# Altium schematic sheet Motor_driver.SchDoc
size A4; SheetNumber: 3; SheetTotal: 4
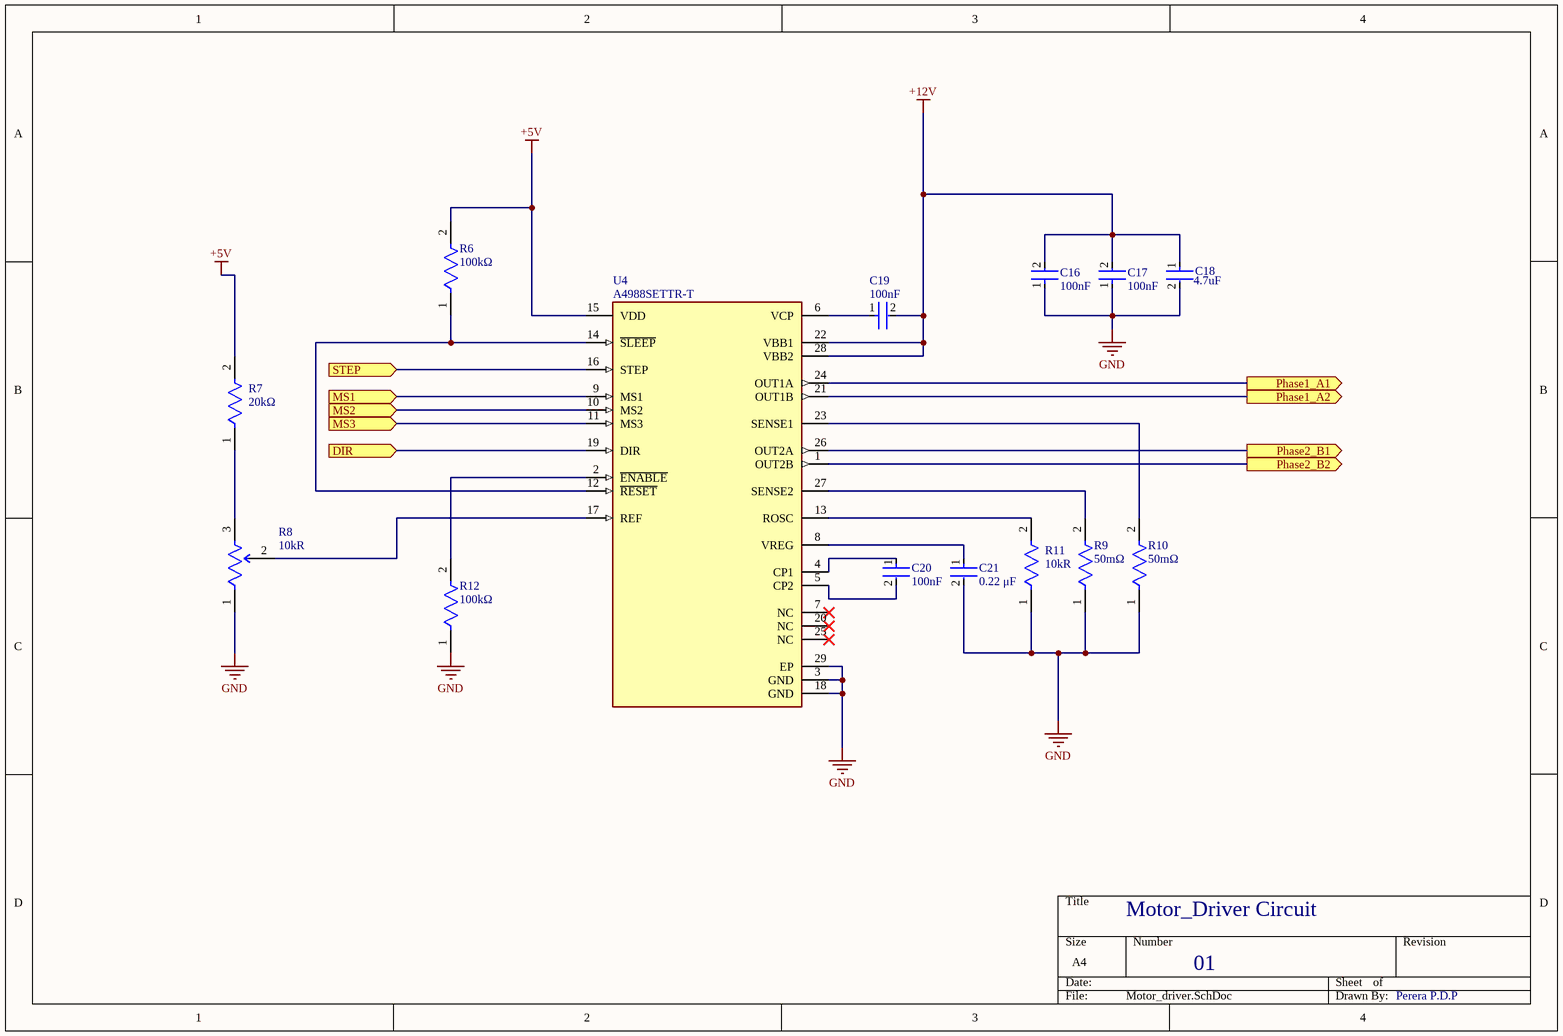
[diagram p0: Motor_driver.SchDoc]

## Parts
C16  Capacitance: 100nF  [FP-0805-L_2_01_0_2-W_1_25-IPC_C]  (hidden comment: 08055C104KAT2A)
C17  Capacitance: 100nF  [FP-0805-L_2_01_0_2-W_1_25-IPC_C]  (hidden comment: 08055C104KAT2A)
C18  Capacitance: 4.7uF  [FP-0805-L_2_01_0_2-W_1_25-MFG]  (hidden comment: 0805YC475KAT2A)
C19  Capacitance: 100nF  [FP-0805-L_2_01_0_2-W_1_25-IPC_C]  (hidden comment: 08055C104KAT2A)
C20  Capacitance: 100nF  [FP-0805-L_2_01_0_2-W_1_25-IPC_C]  (hidden comment: 08055C104KAT2A)
C21  value 0.22 μF  [FP-C0805C-DN-MFG]  (hidden comment: C0805C224K5RACTU)
R6  Resistance: 100kΩ  [FP-RC0805-0_6-IPC_C]  (hidden comment: RC0805FR-07100KL)
R7  Resistance: 20kΩ  [FP-ERA6A-MFG]  (hidden comment: ERA6AEB203V)
R8  Resistance: 10kR  [FP-3361P-MFG]  (hidden comment: 3361P-1-103GLF)
R9  Resistance: 50mΩ  [FP-WSL2512-MFG]  (hidden comment: WSL2512R0500FEA)
R10  Resistance: 50mΩ  [FP-WSL2512-MFG]  (hidden comment: WSL2512R0500FEA)
R11  Resistance: 10kR  [FP-CRCW0805-e3-IPC_A]  (hidden comment: CRCW080510K0FKEA)
R12  Resistance: 100kΩ  [FP-RC0805-0_6-IPC_C]  (hidden comment: RC0805FR-07100KL)
U4  A4988SETTR-T  [FP-ET-28-MFG]

## Ports
DIR (in, see TOP[3B], MCU[3B]), MS1 (in, see TOP[3B], MCU[3B]), MS2 (in, see TOP[3B], MCU[3B]), MS3 (in, see TOP[3B], MCU[3B]), Phase1_A1 (out, see TOP[3B]), Phase1_A2 (out, see TOP[3B]), Phase2_B1 (out, see TOP[3B]), Phase2_B2 (out, see TOP[3B]), STEP (in, see TOP[3B], MCU[3B])

## Nets
+5V: R6.2 R7.2 U4.15(VDD)
+12V: C16.2 C17.2 C18.1 C19.2 U4.22(VBB1) U4.28(VBB2)
GND: C16.1 C17.1 C18.2 C21.2 R8.1(CCW) R9.1 R10.1 R11.1 R12.1 U4.3(GND) U4.18(GND) U4.29(EP)
DIR: U4.19(DIR) ; port DIR
MS1: U4.9(MS1) ; port MS1
MS2: U4.10(MS2) ; port MS2
MS3: U4.11(MS3) ; port MS3
Phase1_A1: U4.24(OUT1A) ; port Phase1_A1
Phase1_A2: U4.21(OUT1B) ; port Phase1_A2
Phase2_B1: U4.26(OUT2A) ; port Phase2_B1
Phase2_B2: U4.1(OUT2B) ; port Phase2_B2
STEP: U4.16(STEP) ; port STEP
NetC19_1: C19.1 U4.6(VCP)
NetC20_1: C20.1 U4.4(CP1)
NetC20_2: C20.2 U4.5(CP2)
NetC21_1: C21.1 U4.8(VREG)
NetR6_1: R6.1 U4.12(~{RESET}) U4.14(~{SLEEP})
NetR7_1: R7.1 R8.3(CW)
NetR8_2: R8.2(WIPER) U4.17(REF)
NetR9_2: R9.2 U4.27(SENSE2)
NetR10_2: R10.2 U4.23(SENSE1)
NetR11_2: R11.2 U4.13(ROSC)
NetR12_2: R12.2 U4.2(~{ENABLE})

Not connected (* = marked no-connect by the designer): U4 7(NC)* 20(NC)* 25(NC)*

## Notes on the sheet
- Motor_Driver Circuit
- 01
- Perera P.D.P

## Library data of the parts
C16 C17 C19 C20 = CMP-2000-05016-2: General Purpose Ceramic Capacitor, 0805, 100nF, 10%, X7R, 0.15, 50V; Dissipation Factor: 2.5%; Insulation Resistance: 100GR; Voltage Rating (DC): 50V; Package Quantity: 4000; Tolerance: 10%; Voltage Rating: 50V; Dielectric: X7R; Case/Package: 0805; Lead Free: Lead Free; Dielectric Material: Ceramic; Thickness: 0.037inch; Weight: 0.001411oz; Max Operating Temperature: 125°C; REACH SVHC: No SVHC; Mount: Surface Mount; RoHS Compliant: Yes; Depth: 1.25mm; Height: 0.5mm; Case Code (Metric): 2012; Length: 2mm; Termination: Standard; Case Code (Imperial): 0805; Number of Pins: 2; Voltage: 50V; Radiation Hardening: No; Min Operating Temperature: -55°C; Width: 1.2mm; Series: MLCC X7R; Packaging: Cut Tape
C18 = CMP-2007-04518-2: General Purpose Ceramic Capacitor, 0805, 4.7uF, 10%, X7R, 15%, 16V; Dissipation Factor: 3.5%; Voltage: 10V; Height: 1.52mm; Package Quantity: 1; Voltage Rating: 16V; RoHS Compliant: Yes; Mount: Surface Mount; REACH SVHC: No SVHC; Number of Pins: 2; Packaging: Tape and Reel; Radiation Hardening: No; Thickness: 0.06inch; Width: 0.049inch; Length: 2.01mm; Termination: SMD/SMT; Case Code (Metric): 2012; Max Operating Temperature: 125°C; Construction: Flat; Series: -; Depth: 1.25mm; Voltage Rating (DC): 16V; Dielectric: X7R; Contact Plating: Tin; Tolerance: 10%; Lead Free: Lead Free; Min Operating Temperature: -55°C; Case Code (Imperial): 0805; Case/Package: 0805
C21 = CMP-1036-04552-2: CAP CER 0.22UF 50V X7R 0805; Manufacturer: KEMET; Temperature Coefficient: 30ppm/°C; Material: Ceramic; Tolerance: 0.1; ComponentLink2URL: https://content.kemet.com/datasheets/KEM_C1003_C0G_SMD.pdf; Temperature Characteristic: X7R; Device Class L3: Ceramic Capacitors; Lead Free: Yes; Temperature: -55°C to +125°C; RoHS: TRUE; Capacitance: 0.22 μF; Automotive: No; Octopart: https://octopart.com/c0805c224k5ractu-kemet-144670; Manufacturer Part Number: C0805C224K5RACTU; Temperature Range Low: -55°C; Height: 0.88mm; Device Class L1: Passive Components; Digikey Description: CAP CER 0.22UF 50V X7R 0805; ComponentLink2Description: Datasheet; Mouser Description: CAP CER 0.22UF 50V X7R 0805; Category: Cap; Ipc Land Pattern Name: CAPC200125X78; Temperature Range High: +125°C; Package: C0805C-DN; Device Class L2: Capacitors; Voltage Rating: 50 V
R6 R12 = CMP-2100-03668-5: RES 100K OHM 1% 1/8W 0805; Power Rating: 125mW; Temperature Coefficient: 100ppm/°C; Voltage Rating (DC): 150V; Package Quantity: 1; Case/Package: 0805; Lead Pitch: 0.4mm; Case Code (Imperial): 0805; Construction: Rectangular; Number of Terminations: 2; RoHS Compliant: Yes; Max Power Dissipation: 125mW; Tolerance: 1%; Max Operating Temperature: 155°C; Resistance Tolerance: 1%; Lead Free: Lead Free; Packaging: Tape and Reel; Resistor Type: Thick Film; Min Operating Temperature: -55°C; Case Code (Metric): 2012; Series: RC; Technology: THICK FILM; Voltage Rating: 150V; Termination: SMD/SMT; Width: 0.049inch; Number of Pins: 2; Features: Moisture Resistant; Military Standard: Not; Length: 0.079inch; Depth: 1.25mm; Size Code: 0805; Height: 0.024inch
R7 = CMP-2001-00610-2: RES 20K OHM 0.1% 1/8W 0805; Power Rating: 125mW; Voltage Rating (DC): 100V; Temperature Coefficient: 25ppm/°C; REACH SVHC: No SVHC; Features: Automotive AEC-Q200; Tolerance: 0.1%; Size Code: 0805; Max Power Dissipation: 125mW; Termination: SMD/SMT; Package Quantity: 1; Resistor Type: Thin Film; Number of Pins: 2; Width: 1.25mm; Technology: THIN FILM; Min Operating Temperature: -55°C; Length: 2mm; Mount: Surface Mount; Height: 0.5mm; Resistance Tolerance: 0.1%; Military Standard: Not; Case Code (Imperial): 0805; Contact Plating: Tin; Case Code (Metric): 2012; Number of Terminations: 2; RoHS Compliant: Yes; Voltage Rating: 100V; Lead Free: Lead Free; Depth: 1.25mm; Construction: Rectangular; Case/Package: 0805; Radiation Hardening: No; Series: ERA-6A; Max Operating Temperature: 155°C; Packaging: Tape and Reel
R8 = CMP-07234-000045-1: TRIMMER 10K OHM 0.5W GW TOP ADJ; Power Rating: 500mW; Temperature Coefficient: 100ppm/°C; Tolerance: 10%; Voltage Rating (DC): 300V; Number of Turns: 1; RoHS Compliant: Yes; Technology: CERMET; Packaging: Tape and Reel; Width: 0.264inch; Weight: 0.567g; Max Operating Temperature: 125°C; REACH SVHC: No SVHC; Series: Trimpot® 3361 - Sealed; Lead Free: Lead Free; Depth: 8.53mm; Taper: Linear; Package Quantity: 1; Min Operating Temperature: -55°C; Termination: Gull Wing; Radiation Hardening: No; Height: 0.205inch; Contact Plating: Tin; Voltage Rating: 300V; Length: 6.71mm; Max Power Dissipation: 500mW; Mount: Surface Mount; Military Standard: Not; Color: Natural; Resistor Type: Cermet; Resistance Tolerance: 10%
R9 R10 = CMP-2000-07420-2: RES 0.05 OHM 1% 1W 2512; Manufacturer: Vishay; 3DS Part Number: 110-00001; Temperature Coefficient: 75ppm/°C; Automotive Grade: Grade 0; Value: 50mΩ; Automotive: Yes; Tolerance: 1%; Device Class L3: Chip SMD Resistors; Category: Res; Package: WSL2512; Lead Free: Yes; Octopart: https://octopart.com/wsl2512r0500fea-vishay-39744678; ComponentLink2URL: http://www.vishay.com/docs/30100/wsl.pdf; Height: 0.889mm; Composition: Metal Element; Temperature Range High: +170°C; ComponentLink2Description: Datasheet; Digikey Description: RES 0.05 OHM 1% 1W 2512; Series: WSL; Temperature: -65°C to +170°C; Temperature Range Low: -65°C; Manufacturer Part Number: WSL2512R0500FEA; Device Class L1: Passive Components; RoHS: TRUE; Power Rating: 1W; Ipc Land Pattern Name: RESC635318X64; Device Class L2: Resistors
R11 = CMP-2001-04908-2: RES Thick Film, 10kΩ, 1%, 0.125W, 100ppm/°C, 0805; Voltage Rating (DC): 150V; Power Rating: 125mW; Weight: 0.000194oz; Package Quantity: 5000; Military Standard: Not; Max Operating Temperature: 155°C; Temperature Coefficient: 100ppm/°C; Contact Plating: Tin; Width: 1.25mm; Height: 0.45mm; Radiation Hardening: No; Tolerance: 1%; Min Operating Temperature: -55°C; Voltage Rating: 150V; Length: 2mm; Depth: 1.25mm; Termination: SMD/SMT; Packaging: Tape and Reel; Case/Package: 0805; Case Code (Metric): 2012; Lead Free: Lead Free; Case Code (Imperial): 0805; Composition: Thick Film
U4 = CMP-1742-00003-2: IC MTR DRVR BIPOLAR 3-5.5V 28QFN; Number of Outputs: 1; Motor Type: Stepper; Output Current: 2A; Min Supply Voltage: 8V; Output Voltage: 35V; Package Quantity: 1; Max Operating Temperature: 85°C; Case/Package: QFN EP; Mount: Surface Mount; Packaging: Tape and Reel; Radiation Hardening: No; REACH SVHC: No SVHC; Min Operating Temperature: -20°C; Max Supply Voltage: 35V; Number of Pins: 28